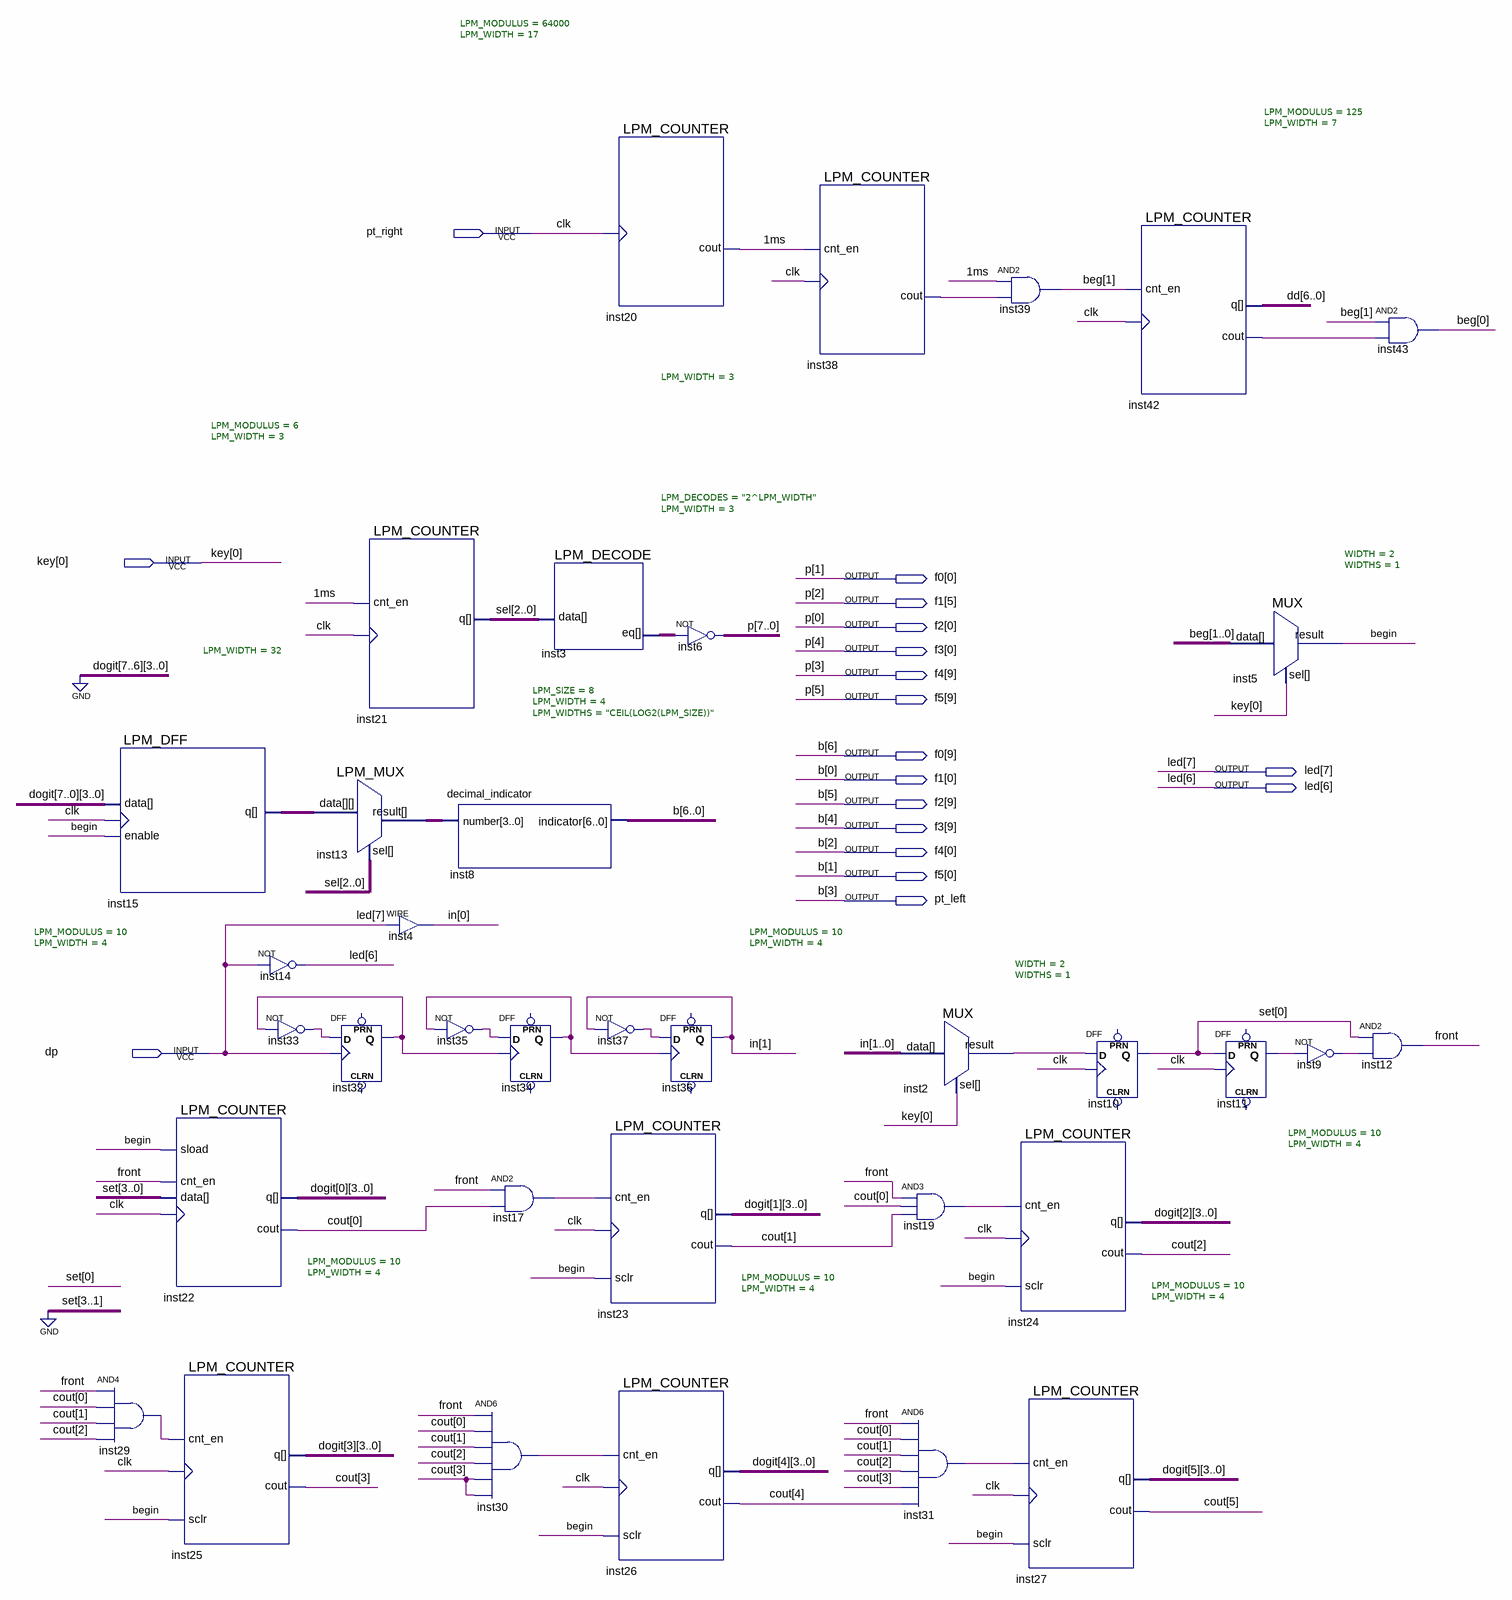
[diagram p0: schematic sheet]
// Quartus schematic max2.bdf as structural Verilog: 36 symbols, 18 pins
module max2 (
  input  pt_right,
  input  [0:0] key,
  input  dp,
  output [9:0] f0,
  output [5:0] f1,
  output [9:0] f2,
  output [9:0] f3,
  output [9:0] f4,
  output [9:0] f5,
  output [7:6] led,
  output pt_left
);

  wire \1ms , \begin , front, inst2_result, inst9_out, inst11_q, inst17_out, inst19_out, inst29_out,
       inst30_out, inst31_out, inst32_q, inst33_out, inst34_q, inst35_out, inst37_out, inst38_cout,
       inst42_cout;
  wire [0:0] set;
  wire [1:0] beg, in;
  wire [2:0] sel;
  wire [3:0] dogit_0, dogit_1, dogit_2, dogit_3, dogit_4, dogit_5, inst13_result;
  wire [5:0] cout;
  wire [6:0] dd;
  wire [7:0] inst3_eq;
  wire [7:6] p;
  wire [31:0] inst15_q;

  and inst29 (inst29_out, front, cout[0], cout[1], cout[2]);
  LPM_DFF #(.LPM_WIDTH(32)) inst15 (
    .enable(\begin ), .clock(pt_right),
    .data({{8{1'b0}}, dogit_5, dogit_4, dogit_3, dogit_2, dogit_1, dogit_0}), .q(inst15_q));
  LPM_COUNTER #(.LPM_MODULUS(10), .LPM_WIDTH(4)) inst22 (
    .sload(\begin ), .cnt_en(front), .data({3'b000, set[0]}), .clock(pt_right), .q(dogit_0), .cout(cout[0]));
  LPM_COUNTER #(.LPM_MODULUS(10), .LPM_WIDTH(4)) inst25 (
    .cnt_en(inst29_out), .clock(pt_right), .sclr(\begin ), .q(dogit_3), .cout(cout[3]));
  not inst14 (led[6], dp);
  not inst33 (inst33_out, inst32_q);
  LPM_COUNTER #(.LPM_MODULUS(6), .LPM_WIDTH(3)) inst21 (.cnt_en(\1ms ), .clock(pt_right), .q(sel));
  LPM_MUX #(.LPM_SIZE(8), .LPM_WIDTH(4), .LPM_WIDTHS("CEIL(LOG2(LPM_SIZE))")) inst13 (
    .data(inst15_q), .sel(sel), .result(inst13_result));
  DFF inst32 (.CLK(dp), .D(inst33_out), .Q(inst32_q));  // open: CLRN, PRN
  assign in[0] = dp;  // WIRE inst4
  decimal_indicator inst8 (.number(inst13_result), .indicator({f0[9], f2[9], f3[9], pt_left, f4[0], f5[0], f1[0]}));
  not inst35 (inst35_out, inst34_q);
  and inst30 (inst30_out, front, cout[0], cout[1], cout[2], cout[3], cout[3]);
  LPM_DECODE #(.LPM_DECODES("2^LPM_WIDTH"), .LPM_WIDTH(3)) inst3 (.data(sel), .eq(inst3_eq));
  DFF inst34 (.CLK(inst32_q), .D(inst35_out), .Q(inst34_q));  // open: CLRN, PRN
  and inst17 (inst17_out, front, cout[0]);
  LPM_COUNTER #(.LPM_MODULUS(64000), .LPM_WIDTH(17)) inst20 (.clock(pt_right), .cout(\1ms ));
  not inst37 (inst37_out, in[1]);
  LPM_COUNTER #(.LPM_MODULUS(10), .LPM_WIDTH(4)) inst23 (
    .cnt_en(inst17_out), .clock(pt_right), .sclr(\begin ), .q(dogit_1), .cout(cout[1]));
  LPM_COUNTER #(.LPM_MODULUS(10), .LPM_WIDTH(4)) inst26 (
    .cnt_en(inst30_out), .clock(pt_right), .sclr(\begin ), .q(dogit_4), .cout(cout[4]));
  assign {p, f5[9], f3[0], f4[9], f1[5], f0[0], f2[0]} = ~inst3_eq;  // NOT inst6, 8 bits wide
  DFF inst36 (.CLK(inst34_q), .D(inst37_out), .Q(in[1]));  // open: CLRN, PRN
  LPM_COUNTER #(.LPM_WIDTH(3)) inst38 (.cnt_en(\1ms ), .clock(pt_right), .cout(inst38_cout));
  MUX #(.WIDTH(2), .WIDTHS(1)) inst2 (.data(in), .sel(key[0]), .result(inst2_result));
  and inst19 (inst19_out, front, cout[0], cout[1]);
  and inst31 (inst31_out, front, cout[0], cout[1], cout[2], cout[3], cout[4]);
  and inst39 (beg[1], \1ms , inst38_cout);
  LPM_COUNTER #(.LPM_MODULUS(10), .LPM_WIDTH(4)) inst24 (
    .cnt_en(inst19_out), .clock(pt_right), .sclr(\begin ), .q(dogit_2), .cout(cout[2]));
  LPM_COUNTER #(.LPM_MODULUS(10), .LPM_WIDTH(4)) inst27 (
    .cnt_en(inst31_out), .clock(pt_right), .sclr(\begin ), .q(dogit_5), .cout(cout[5]));
  LPM_COUNTER #(.LPM_MODULUS(125), .LPM_WIDTH(7)) inst42 (
    .cnt_en(beg[1]), .clock(pt_right), .q(dd), .cout(inst42_cout));
  DFF inst10 (.CLK(pt_right), .D(inst2_result), .Q(set[0]));  // open: CLRN, PRN
  MUX #(.WIDTH(2), .WIDTHS(1)) inst5 (.data(beg), .sel(key[0]), .result(\begin ));
  DFF inst11 (.CLK(pt_right), .D(set[0]), .Q(inst11_q));  // open: CLRN, PRN
  not inst9 (inst9_out, inst11_q);
  and inst43 (beg[0], beg[1], inst42_cout);
  and inst12 (front, set[0], inst9_out);

  assign led[7] = dp;

  // Other names for the same wires on the sheet: b[6:0] = {f0[9], f2[9], f3[9], pt_left, f4[0], f5[0], f1[0]};
  //   clk = pt_right; p[5:0] = {f5[9], f3[0], f4[9], f1[5], f0[0], f2[0]}
endmodule
